# EAGLE design relay_module (EAGLE 9.6.2)
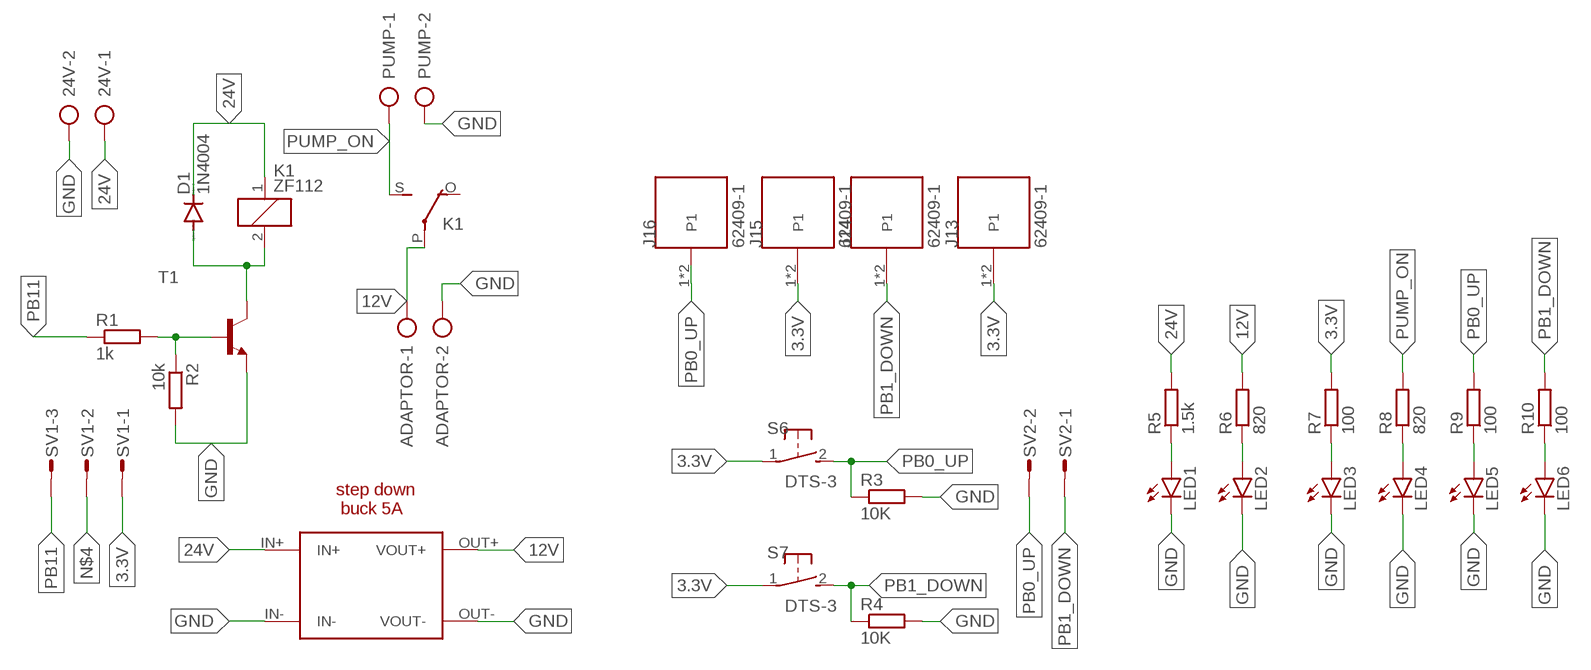
[diagram p0: schematic, sheet 1]

## Parts
24V  AK300/2  [AK300/2]
ADAPTOR  AK300/2  [AK300/2]
D1  1N4004  [DO41-10]
J13  62409-1  [TE_62409-1]
J14  62409-1  [TE_62409-1]
J15  62409-1  [TE_62409-1]
J16  62409-1  [TE_62409-1]
K1  ZF112  [ZF112]
LED1  LED5MM  [LED5MM]
LED2  LED5MM  [LED5MM]
LED3  LED5MM  [LED5MM]
LED4  LED5MM  [LED5MM]
LED5  LED5MM  [LED5MM]
LED6  LED5MM  [LED5MM]
PUMP  AK300/2  [AK300/2]
R1  1k  R-EU_0204/7  [0204/7]
R2  10k  R-EU_0204/7  [0204/7]
R3  10K  R-EU_0204/7  [0204/7]
R4  10K  R-EU_0204/7  [0204/7]
R5  1.5k  R-EU_0204/7  [0204/7]
R6  820  R-EU_0204/7  [0204/7]
R7  100  R-EU_0204/7  [0204/7]
R8  820  R-EU_0204/7  [0204/7]
R9  100  R-EU_0204/7  [0204/7]
R10  100  R-EU_0204/7  [0204/7]
S6  DTS-3  [DTS-3]
S7  DTS-3  [DTS-3]
SV1  CON-AMP-MT_S03P  [CON-AMP-MT_S03P]
SV2  CON-AMP-MT_S02P  [CON-AMP-MT_S02P]
T1  2N2222-NPN-TO92-EBC  [TO92-EBC]
U$1  BUCK_5A  [BUCK_5A]

## Nets
3.3V: J13.1 J13.2(P1) J15.1 J15.2(P1) R7.2 S6.1 S7.1 SV1.1
12V: ADAPTOR.1 K1.P(2:P) R6.2 U$1.OUT+(VOUT+)
24V: 24V.1 D1.C K1.1 R5.2 U$1.IN+
GND: 24V.2 ADAPTOR.2 LED1.K(C) LED2.K(C) LED3.K(C) LED4.K(C) LED5.K(C) LED6.K(C) PUMP.2 R2.2 R3.2 R4.2 T1.E U$1.IN- U$1.OUT-(VOUT-)
N$1: R1.2 R2.1 T1.B
N$2: LED1.A R5.1
N$3: D1.A K1.2 T1.C
N$4: SV1.2
N$5: LED2.A R6.1
N$6: LED5.A R9.1
N$7: LED3.A R7.1
N$8: LED4.A R8.1
N$9: LED6.A R10.1
PB0_UP: J16.1 J16.2(P1) R3.1 R9.2 S6.2 SV2.2
PB1_DOWN: J14.1 J14.2(P1) R4.1 R10.2 S7.2 SV2.1
PB11: R1.1 SV1.3
PUMP_ON: K1.S(2:S) PUMP.1 R8.2
Unconnected: K1.O(2:O)

## Library data of the parts
24V ADAPTOR PUMP = con-ptr500:AK300/2: CONNECTOR; OC_FARNELL: unknown; OC_NEWARK: unknown
D1 = diode:1N4004: DIODE general purpose rectifier, 1 A
J13-J16 = 62409-1:62409-1: CONN QC TAB 0.250 SOLDER Check availability <https://pricing.snapeda.com/parts/62409-1/TE%20Connectivity/view-part?ref=eda>; AVAILABILITY: In Stock; COMMENT: 62409-1; DESCRIPTION: Faston 20-16 AWG Straight Non-Insulated Printed Circuit Board Tab Terminal; MF: TE Connectivity; MP: 62409-1; PACKAGE: None; PRICE: None; PURCHASE-URL: https://pricing.snapeda.com/search/part/62409-1/?ref=eda
K1 = relay:ZF112: RELAY 1 x switch; OC_FARNELL: unknown; OC_NEWARK: unknown
LED1-LED6 = led:LED: LED OSRAM: - CHIPLED LG R971, LG N971, LY N971, LG Q971, LY Q971, LO R971, LY R971 LH N974, LH R974 LS Q976, LO Q976, LY Q976 LO Q996 - Hyper CHIPLED LW Q18S LB Q993, LB Q99A, LB R99A - SideLED LS A670, LO A670, LY A670, LG A670, LP A670 LB A673, LV A673, LT A673, LW A673 LH A674 LY A675 LS A676, LA A676, LO A676, LY A676, LW A676 LS A679, LY A679, LG A679 - Hyper Micro SIDELED® LS Y876, LA Y876, LO Y876, LY Y876 LT Y87S - SmartLED LW L88C, LW L88S LB L89C, LB L89S, LG L890 LS L89K, LO L89K, LY L89K LS L896, LA L896, LO L896, LY L896 - TOPLED LS T670, LO T670, LY T670, LG T670, LP T670 LSG T670, LSP T670, LSY T670, LOP T670, LYG T670 LG T671, LOG T671, LSG T671 LB T673, LV T673, LT T673, LW T673 LH T674 LS T676, LA T676, LO T676, LY T676, LB T676, LH T676, LSB T676, LW T676 LB T67C, LV T67C, LT T67C, LS T67K, LO T67K, LY T67K, LW E67C LS E67B, LA E67B, LO E67B, LY E67B, LB E67C, LV E67C, LT E67C LW T67C LS T679, LY T679, LG T679 LS T770, LO T770, LY T770, LG T770, LP T770 LB T773, LV T773, LT T773, LW T773 LH T774 LS E675, LA E675, LY E675, LS T675 LS T776, LA T776, LO T776, LY T776, LB T776 LHGB T686 LT T68C, LB T68C - Hyper Mini TOPLED® LB M676 - Mini TOPLED Santana® LG M470 LS M47K, LO M47K, LY M47K Source: http://www.osram.convergy.de LUXEON: - LUMILED® LXK2-PW12-R00, LXK2-PW12-S00, LXK2-PW14-U00, LXK2-PW14-V00 LXK2-PM12-R00, LXK2-PM12-S00, LXK2-PM14-U00 LXK2-PE12-Q00, LXK2-PE12-R00, LXK2-PE12-S00, LXK2-PE14-T00, LXK2-PE14-U00 LXK2-PB12-K00, LXK2-PB12-L00, LXK2-PB12-M00, LXK2-PB14-N00, LXK2-PB14-P00, LXK2-PB14-Q00 LXK2-PR12-L00, LXK2-PR12-M00, LXK2-PR14-Q00, LXK2-PR14-R00 LXK2-PD12-Q00, LXK2-PD12-R00, LXK2-PD12-S00 LXK2-PH12-R00, LXK2-PH12-S00 LXK2-PL12-P00, LXK2-PL12-Q00, LXK2-PL12-R00 Source: www.luxeon.com KINGBRIGHT: KA-3528ASYC Source: www.kingbright.com
R1 R2 R5-R10 = rcl:R-EU_: RESISTOR, European symbol; SPICEPREFIX: R
R3 R4 = resistor:R-EU_: RESISTOR, European symbol
S6 S7 = switch-tact:DTS-3
SV1 = MindCloud:CON-AMP-MT_S03P: AMP MT CONNECTOR; OC_FARNELL: unknown; OC_NEWARK: unknown
SV2 = MindCloud:CON-AMP-MT_S02P: AMP MT CONNECTOR; OC_FARNELL: unknown; OC_NEWARK: unknown
T1 = transistor-neu-to92:*-NPN-: NPN Transistror
U$1 = MindCloud:BUCK_5A

## Board
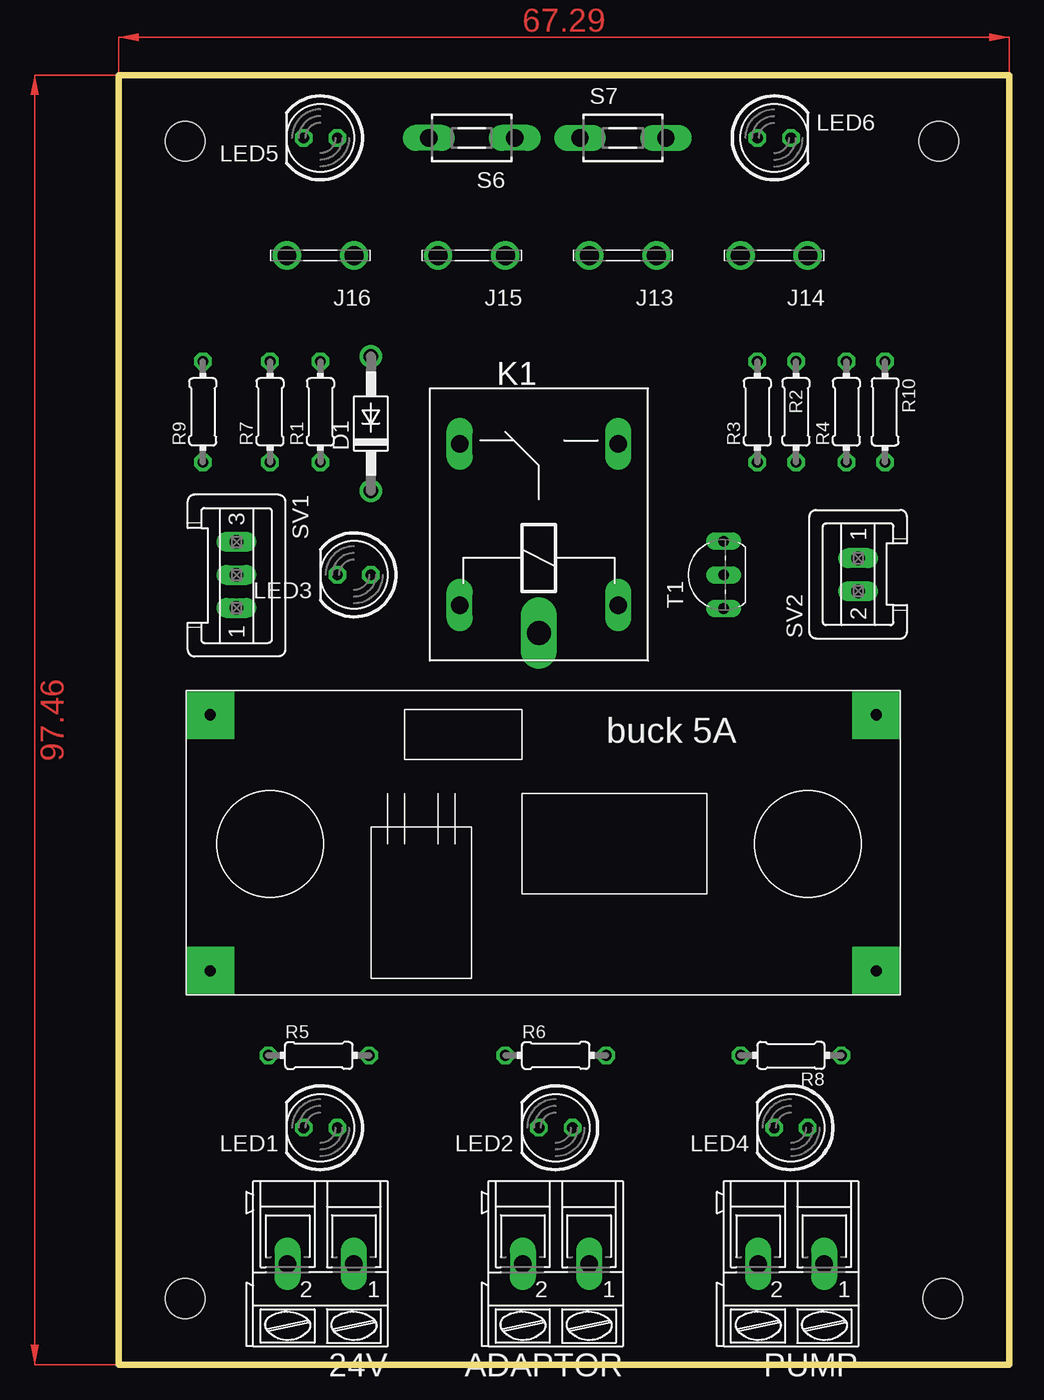
[diagram p1: board, top side]
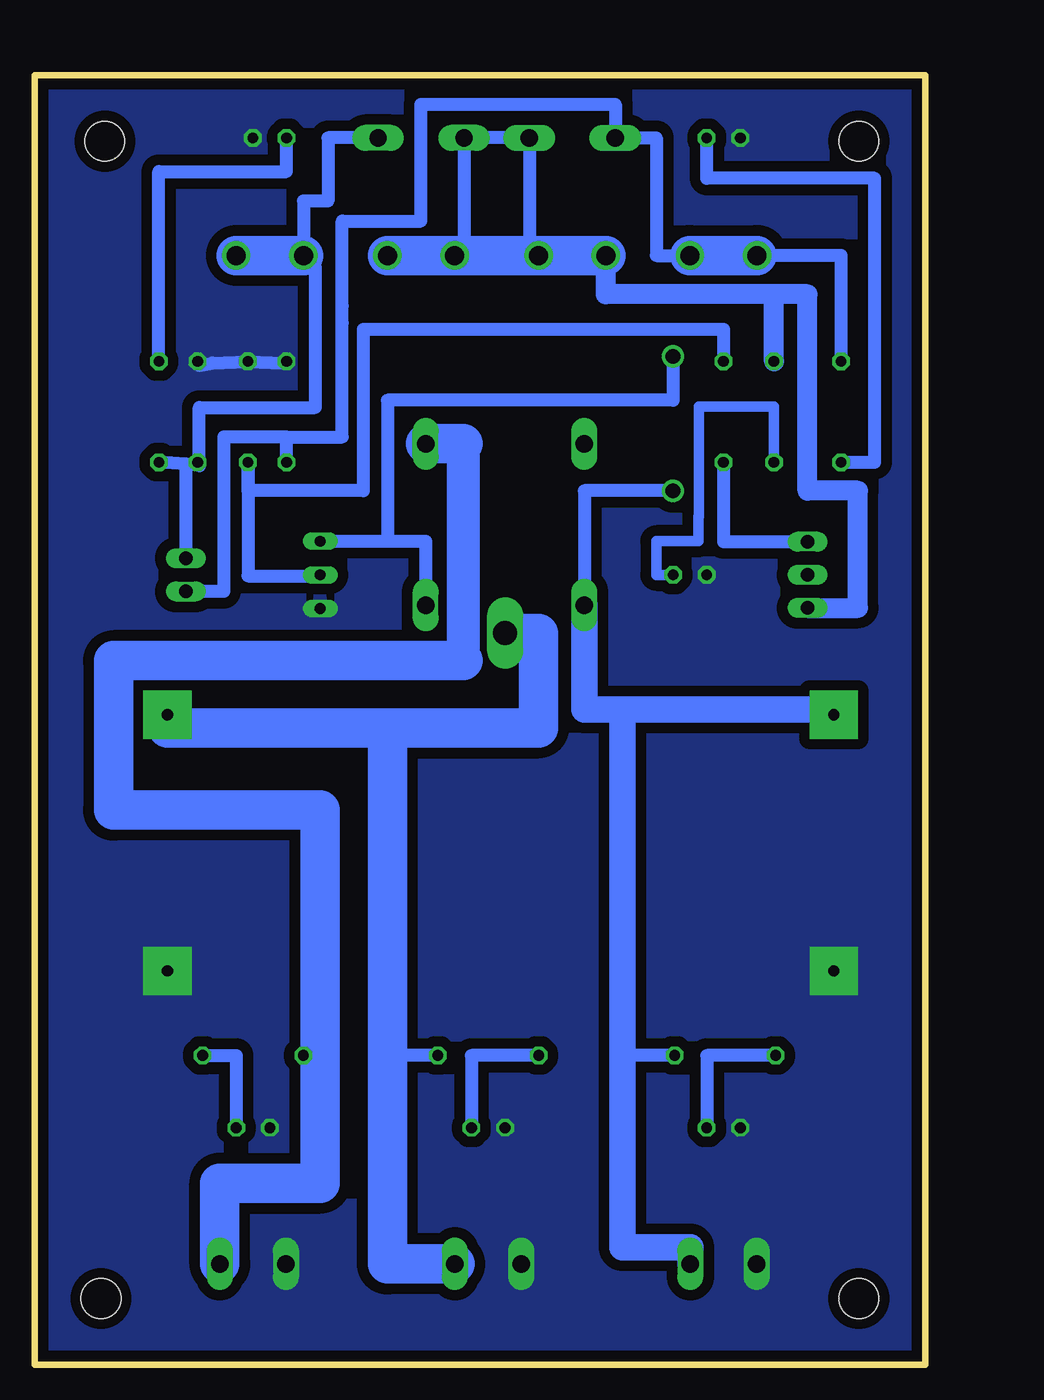
[diagram p2: board, bottom side, seen from below]

Size 67.29 x 97.46 mm. Coordinates in mm from the lower left corner, seen from the top.
Outline: 0,0 67.29,0 67.29,97.46 0,97.46 0,0
Copper layers (1*16): Top 0.035mm / dielectric 1.5mm / Bottom 0.035mm
Design rules "default *": minimum track width 0.8mm, minimum drill 0.35mm, track to track 0.5mm, track to pad 0.6mm, pad to pad 0.6mm, via to via 0.6mm, smd to smd 6mil, copper to edge 0.6mm, drill to drill 0.6mm, minimum pad ring 10mil, minimum via ring 8mil, stop-mask expansion 4mil, vias tented up to drill 0mil, thermal gap 0mil
Holes 3 mm at 5,5 5,92.46 61.99,92.46 62.29,5

### Footprints (pad centres in the part's own frame; a part is rotated, then mirrored left to right if it is on the bottom)
AK300/2 = drill 1.321 long: 1 -2.515,0; 2 2.489,0
DO41-10 = drill 1.118: A 5.08,0; C -5.08,0
TE_62409-1 = drill 1.43: 1 -2.54,0; 2 2.54,0
ZF112 = drill 1.321 long: 1 -6.096,5.994; 2 -6.096,-5.994; O 6.096,5.994; S 6.096,-5.994 | drill 1.803 long: P -8.204,0
LED5MM = drill 0.813 octagon: A -1.27,0; K 1.27,0
0204/7 = drill 0.813 octagon: 1 -3.81,0; 2 3.81,0
DTS-3 = drill 1.3 long: 1 -3.25,0; 2 3.25,0
CON-AMP-MT_S03P = drill 1.016 long: 1 2.5,0; 2 0,0; 3 -2.5,0
CON-AMP-MT_S02P = drill 1.016 long: 1 1.25,0; 2 -1.25,0
TO92-EBC = drill 0.813 long: B 0,-1.27; C 2.54,-1.27; E -2.54,-1.27
BUCK_5A = drill 0.85 pad 3.65 square: IN+ 1.82,21.18; IN- 1.82,1.82; OUT+ 52.18,21.18; OUT- 52.18,1.82

### Placement (x,y rotation side)
24V  15.24,7.62 180 top
ADAPTOR  33.02,7.62 180 top
D1  19.05,71.12 90 top
J13  38.1,83.82 180 top
J14  49.53,83.82 180 top
J15  26.67,83.82 180 top
J16  15.24,83.82 180 top
K1  31.75,63.5 90 top
LED1  15.24,17.91 180 top
LED2  33.02,17.91 180 top
LED3  17.78,59.69 180 top
LED4  50.8,17.91 180 top
LED5  15.24,92.71 180 top
LED6  49.53,92.71 0 top
PUMP  50.8,7.62 180 top
R1  15.24,72.01 90 top
R2  51.18,72.01 90 top
R3  48.26,72.01 90 top
R4  54.99,72.01 90 top
R5  15.11,23.37 0 top
R6  33.02,23.37 0 top
R7  11.43,72.01 90 top
R8  50.8,23.37 180 top
R9  6.35,72.01 90 top
R10  57.91,72.01 270 top
S6  26.67,92.71 180 top
S7  38.1,92.71 0 top
SV1  8.89,59.69 270 top
SV2  55.88,59.69 90 top
T1  44.45,59.69 90 top
U$1  5.08,27.94 0 top

### Tracks (layer width: path | path; a pad name or v marks a point on that pad's centre or on a via)
3.3V
  Bottom 1: J15.1 29.92,83.82 S6.1 S7.1 34.85,83.82 J13.2
  Bottom 1.5: J15.2 24.13,80.9 11.43,80.9 | SV1.1 5.08,57.19 5.08,66.04 8.89,66.04 8.89,80.9 11.43,80.9 | R7.2 11.43,80.9
  Bottom 3: J13.2 J13.1 J15.1 J15.2
12V
  Bottom 1: R6.2 40.64,23.37 40.64,24.13 | K1.P 31.75,55.24 29.21,55.24
  Bottom 3: U$1.OUT+ 57.26,48.13 40.64,48.13 | ADAPTOR.1 40.64,7.62 40.64,24.13 40.64,48.13 | 40.64,48.13 29.21,48.13 29.21,55.24 31.11,55.24 31.11,54.61
24V
  Bottom 1: R5.2 22.86,23.37 22.86,22.86 | D1.C 25.76,66.04 K1.1
  Bottom 2: 24V.1 17.75,8.89 22.86,8.89 22.86,22.86 22.86,49.53 | 22.86,49.53 6.35,49.53 6.35,49.12 U$1.IN+ | K1.1 25.76,49.53 22.86,49.53
GND
  Bottom 1: R3.2 48.51,75.69 R2.2 53.88,75.69 54.89,75.52 R4.2
  pour Bottom (isolate 0.8): -2.54,104.14 71.12,104.14 71.12,-1.27 -2.54,-1.27
N$1
  Bottom 1: R1.2 15.24,78.24 42.46,78.24 42.46,66.04 51.18,66.04 R2.1 51.18,59.61 45.8,59.61 T1.B
N$2
  Bottom 1: R5.1 16.51,23.37 LED1.A
N$3
  Bottom 1: K1.2 37.74,62.23 40.64,62.23 | T1.C 40.64,62.23 | D1.A 19.05,72.88 40.64,72.88 40.64,62.23
N$5
  Bottom 1: R6.1 34.29,23.37 LED2.A
N$6
  Bottom 1: LED5.A 16.51,89.66 3.81,89.66 3.81,68.2 R9.1
N$7
  Bottom 0.8: R7.1 11.43,72.39 17.11,72.39 17.11,64.1 17.14,64.1 17.14,62.23 20.32,62.23 20.32,59.69 LED3.A
N$8
  Bottom 1: R8.1 52.07,23.37 LED4.A
N$9
  Bottom 1: R10.1 57.91,90.17 48.26,90.17 LED6.A
PB0_UP
  Bottom 1: R3.1 48.26,70.1 | J16.1 20.32,83.82 20.32,92.71 S6.2 23.42,95.25 38.1,95.25 38.1,86.42 44.06,86.42 44.06,80.01 44.06,78.74 44.06,70.1 48.26,70.1 | R9.2 6.35,83.82 J16.2 | SV2.2 53,58.44 53,70.1 48.26,70.1
  Bottom 3: J16.1 J16.2
PB1_DOWN
  Bottom 1: 55.88,68.07 55.12,68.07 R4.1 54.86,67.94 54.86,72.34 46.1,72.34 46.1,82.93 J14.2 46.99,87.94 45.13,87.94 45.13,92.71 S7.2 | 55.88,68.07 R10.2 | 55.88,68.07 SV2.1
  Bottom 3: J14.2 J14.1
PB11
  Bottom 1: R1.1 15.24,62.19 SV1.3
PUMP_ON
  Bottom 1: R8.2 45.72,23.37 45.72,22.86
  Bottom 2.5: 34.93,69.6 34.93,53.21
  Bottom 3: PUMP.1 53.32,13.72 45.72,13.72 45.72,22.86 45.72,41.91 61.34,41.91 61.34,53.21 34.93,53.21 | K1.S 34.93,69.6
(copper drawn outside any net)
  shapes: Top area x2

### Text on the board
Document: P UP | P DOWN | UTM | PB11 | PB1 | PB0 | 3.3V | -ve | +ve | -ve | -ve | +ve | -ve | +ve | 24v | 12v | pump